# Altium project PCB_Project.PrjPcb (part 2 of 2)
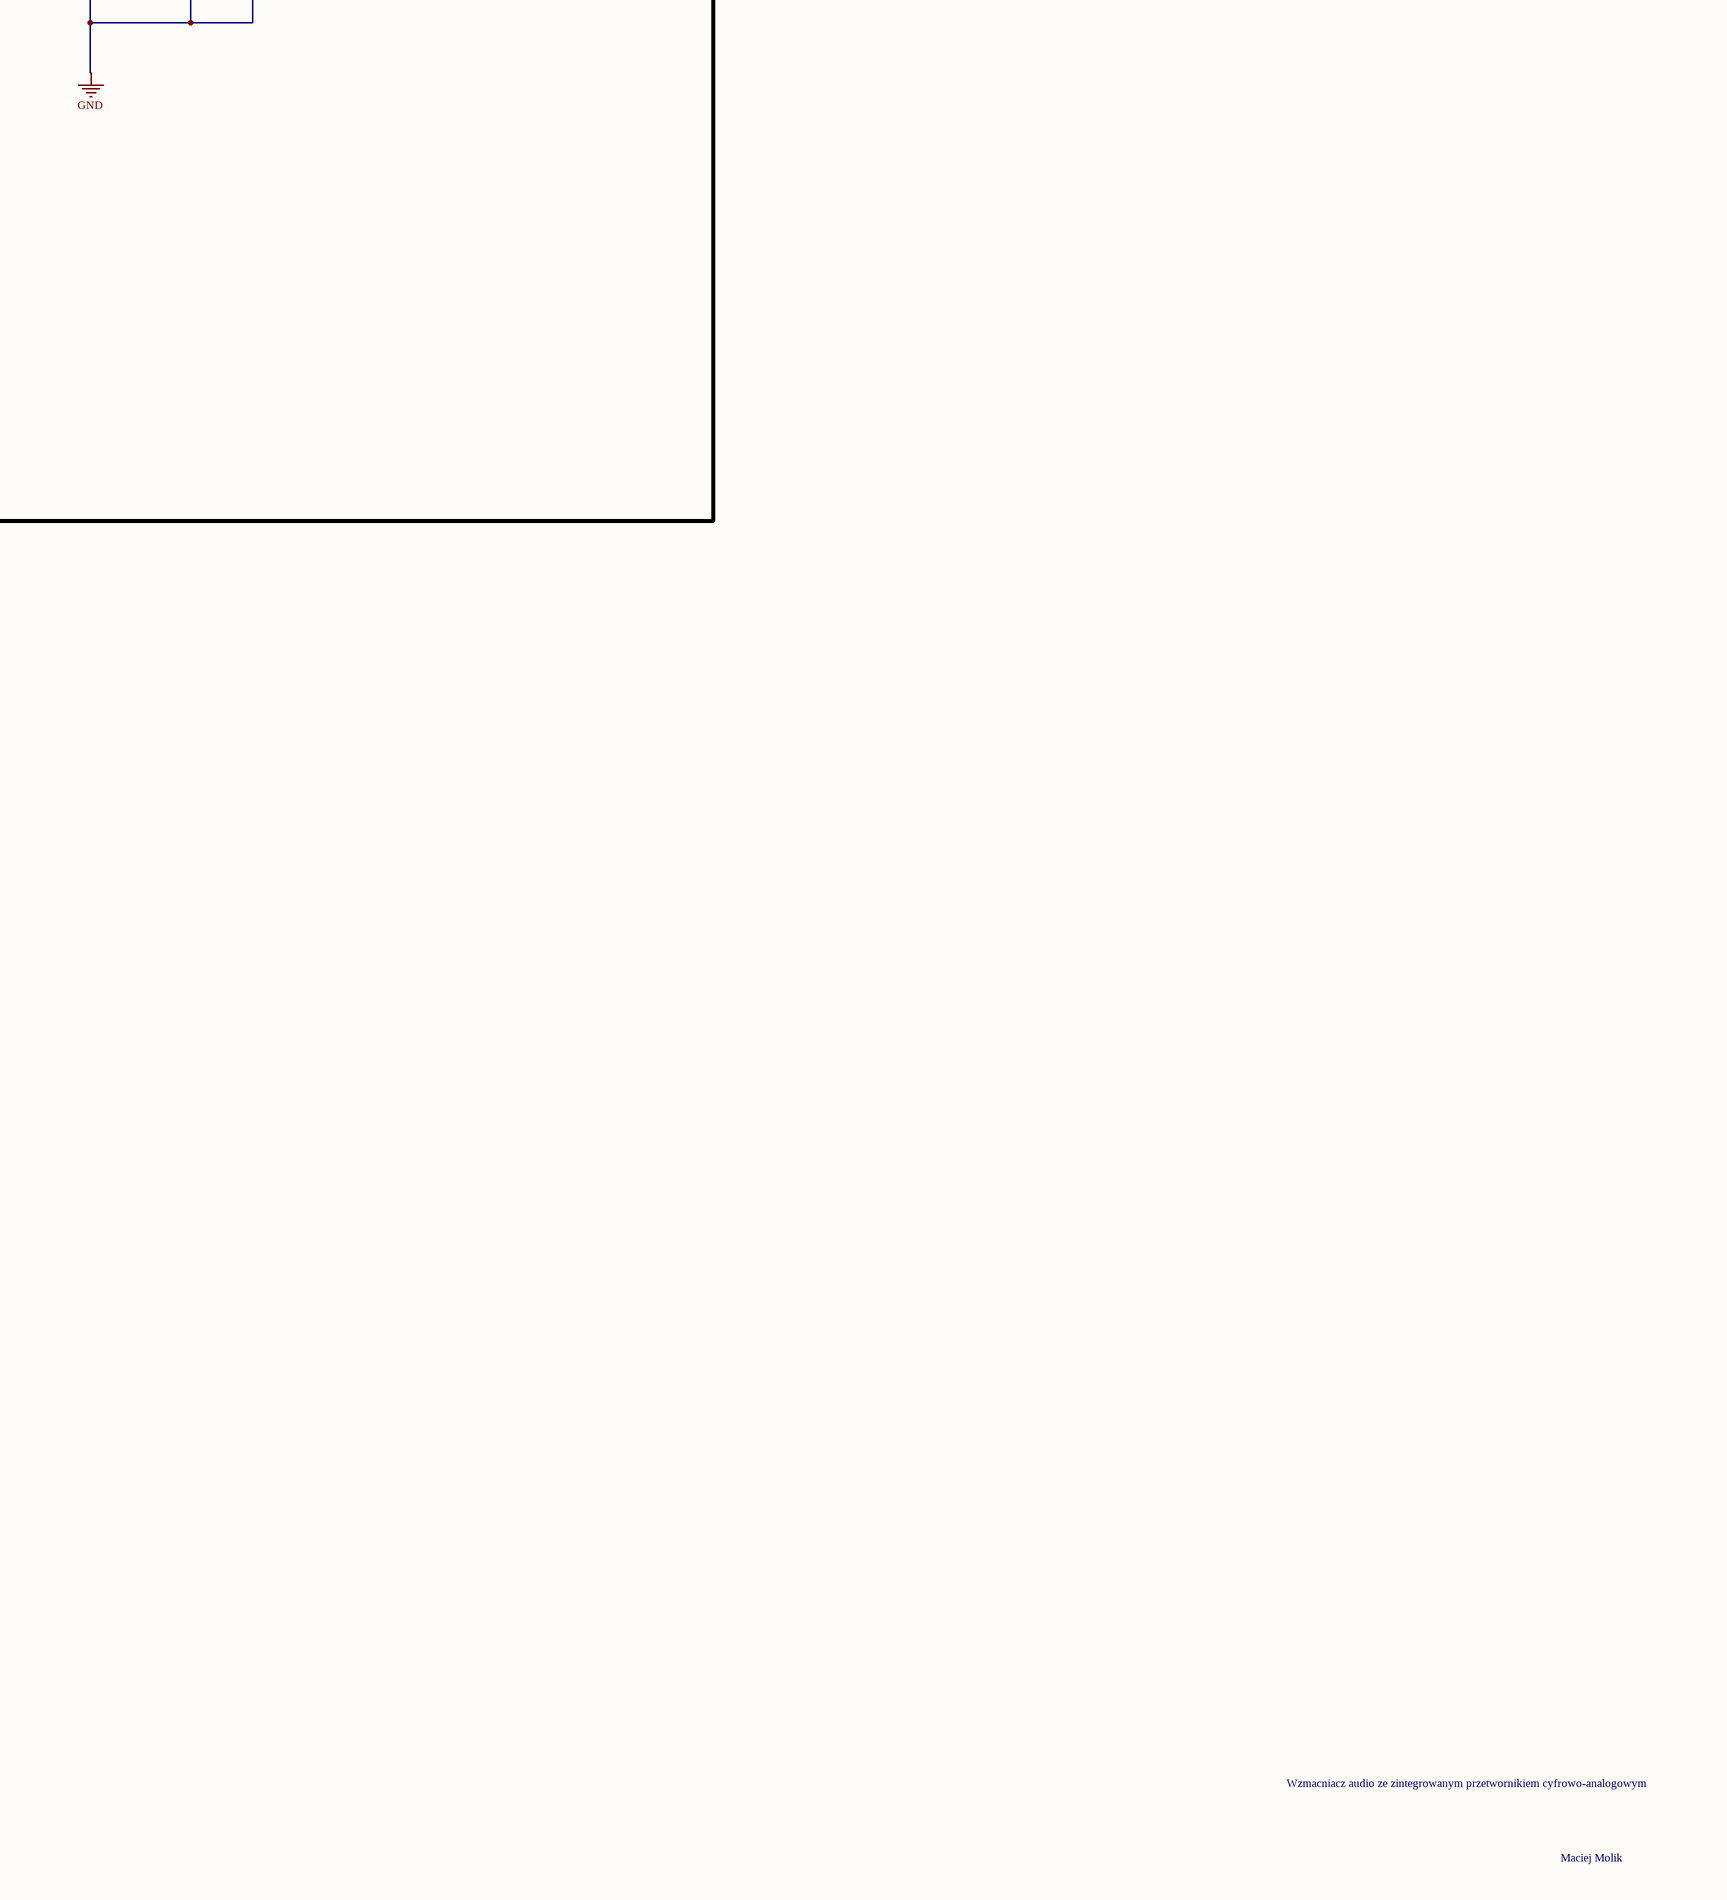
[diagram p6: Wzmacniacz audio.SchDoc, bottom right]

## Sheet Wzmacniacz audio.SchDoc (continued)

### Library data of the parts
C10 C12 C13 C18 C23 C111 = CMP-05427-001036-1: Aluminum Electrolytic Capacitors (Radial Lead Type) AEC-Q200 Qualified 10uF ±20% 50V; Ripple Current: 125mA; ESR (Equivalent Series Resistance): 1.3R; Life (Hours): 1000Hour; Lead Diameter: 0.5mm; Polarity: Polar; Max Operating Temperature: 105°C; Tolerance: 20%; Voltage Rating: 50V; Radiation Hardening: No; Packaging: Tape and Reel; Case/Package: Radial; Contact Plating: Tin; Height - Seated (Max): 0.472inch; Height: 11mm; Lead Pitch: 2.5mm; Mount: Through Hole; Termination: Radial; Impedance: 1.3R; RoHS Compliant: Yes; Diameter: 5mm; Min Operating Temperature: -55°C; Series: FC; Length: 11mm; Voltage Rating (DC): 50V; Package Quantity: 2000; Ratings: AEC-Q200
C11 C14 C15 C19-C22 C24 C26 C28 C45 C54 C56 C58 C59 C210 C212 C214 C216 C218 C220 C222 C224 C226 C228 C235-C238 C246 C247 C250 C251 C253-C256 C264 C265 C412 C511 C513 = CMP-2100-03643-1: Chip Capacitor, 0.1 uF, +/- 10%, 50 V, -55 to 125 degC, 0603 (1608 Metric), RoHS, Tape and Reel; Manufacturer: Murata; Dielectric Material: Ceramic; Voltage Rating: 50V; Dielectric: X7R; Insulation Resistance: 10GR; Case Code (Metric): 1608; Lead Free: LeadFree; Depth: 0.8mm; Number of Pins: 2; Radiation Hardening: No; Case/Package: 0603; Manufacturer URL: http://www.murata.com/; Packaging: TapeandReel; Length: 1.6mm; Contact Plating: Tin; Datasheet URL: http://psearch.en.murata.com/capacitor/product/GRM188R71H104KA93%23.pdf; Tolerance: 10%; Case Code (Imperial): 0603; Min Operating Temperature: -55degC; RoHSCompliant: true; Voltage: 50V; Termination: SMD/SMT; Mount: SurfaceMount; Material: Ceramic; Package Quantity: 1; Height: 0.8mm; Thickness: 0.035inch; REACH SVHC: NoSVHC; Max Operating Temperature: 125degC; Width: 0.8mm; Package Reference: 0603; Voltage Rating (DC): 50V; Datasheet Version: 42675.0; Package Description: 2-Pin Surface Mount Device, Body 1.6 x 0.8 mm
C16 C17 = CMP-2006-03702-3: CAP CER 18PF 50V C0G/NP0 0603; Manufacturer: KEMET; Automotive Grade: Grade 1; Tolerance: 0.05; Temperature Coefficient: 30ppm/°C; Temperature Characteristic: C0G; Material: Ceramic; ComponentLink2URL: https://api.kemet.com/component-edge/download/datasheet/C0603C100J5GACAUTO.pdf; Value: 18 pF; Device Class L3: Ceramic Capacitors; Digikey Description: CAP CER 18PF 50V C0G/NP0 0603; RoHS: TRUE; Category: Cap; Temperature Range Low: -55°C; Lead Free: Yes; Device Class L1: Passive Components; Device Class L2: Capacitors; Package: C0603C-CF; Manufacturer Part Number: C0603C180J5GACTU; Mouser Description: Capacitor; Ceramic; Cap; 18.0pF; Tol 5%; SMT; Vol-Rtg 50V; C0G; Tape and Reel; Temperature Range High: +125°C; Temperature: -55°C to +125°C; Octopart: https://octopart.com/c0603c180j5gactu-kemet-97992; ComponentLink2Description: Datasheet; Automotive: Yes; Voltage Rating: 50 V; Height: 0.87mm
C25 = CMP-2000-07372-2: CAP ALUM 47UF 20% 100V SMD; Life (Hours): 2000Hour; Ripple Current (AC): 230mA; Dissipation Factor: 0.08%; Leakage Current: 141uA; Lead Diameter: 1.1mm; Diameter: 10mm; Termination: SMD/SMT; Voltage: 100V; Tolerance: 20%; Voltage Rating: 100V; Packaging: Tape and Reel; Height - Seated (Max): 0.394inch; Case/Package: Radial; Features: General Purpose; Lead Pitch: 4.5mm; Height: 10mm; Min Operating Temperature: -55°C; REACH SVHC: No SVHC; Radiation Hardening: No; Length: 10mm; RoHS Compliant: Yes; Construction: Cylindrical; Package Quantity: 500; Voltage Rating (DC): 100V; Ripple Current: 230mA; Series: UX; Max Operating Temperature: 105°C; Mount: Surface Mount
C27 C29 C211 C213 C215 C217 C219 C221 C223 C225 C227 C229 = CMP-13271-003017-1: Cap Ceramic 4.7uF 10V X5R ±10% Pad SMD 0603 +85°C T/R; Case/Package: 0603; Packaging: Tape and Reel; Width: 0.031inch; Contact Plating: Tin; Thickness: 0.035inch; Package Quantity: 1; Voltage Rating: 10V; Case Code (Metric): 1608; Case Code (Imperial): 0603; Depth: 0.8mm; Height: 0.8mm; Tolerance: 10%; Max Operating Temperature: 85°C; Length: 1.6mm; Dielectric: X5R; Mount: Surface Mount; Radiation Hardening: No; Min Operating Temperature: -55°C
C40 C47 C50-C53 C55 C57 C510 C512 C514 = CMP-03017-000023-1: CAP TANT 220UF 10% 16V 2917; Leakage Current: 35.2uA; ESR (Equivalent Series Resistance): 900mR; Dielectric Material: Tantalum; Height: 2.8mm; Case/Package: 2917; Length: 7.3mm; Min Operating Temperature: -55°C; Lead Free: Lead Free; Depth: 4.3mm; Voltage Rating: 16V; Width: 0.169inch; Mount: Surface Mount; Max Operating Temperature: 125°C; Series: T491; Construction: Flat; Number of Pins: 2; Voltage Rating (DC): 16V; Packaging: Cut Tape; RoHS Compliant: Yes; Radiation Hardening: No; Case Code (Metric): 7343; Height - Seated (Max): 0.122inch; Termination: SMD/SMT; REACH SVHC: No SVHC; Voltage: 16V; Features: General Purpose; Case Code (Imperial): 2917; Package Quantity: 1; Tolerance: 10%
C41 C43 C44 C49 C410 C411 = CMP-05427-002115-1: CAP ALUM 330UF 20% 35V SMD; ESR (Equivalent Series Resistance): 80mR; Ripple Current: 850mA; Dielectric Material: Aluminium; Lead Length: 3.5mm; Life (Hours): 2000Hour; Leakage Current: 115.5uA; Length: 10.2mm; Construction: Cylindrical; Package Quantity: 500; Termination: SMD/SMT; RoHS Compliant: Yes; Impedance: 80mR; Width: 10.3mm; Height - Seated (Max): 0.402inch; Voltage: 35V; Voltage Rating: 35V; Diameter: 10mm; Contact Plating: Tin; Number of Pins: 2; Case/Package: Radial; Reach SVHC Compliant: Yes; Lead Free: Lead Free; Series: FK; Ripple Current (AC): 850mA; Tolerance: 20%; Ratings: AEC-Q200; Lead Pitch: 4.6mm; Mount: Surface Mount; Height: 10.2mm; Max Operating Temperature: 105°C; Packaging: Tape and Reel; Min Operating Temperature: -55°C; Voltage Rating (DC): 35V; Radiation Hardening: No
C42 C48 = CMP-08246-007079-1: Multilayer Ceramic Capacitors 3.3uF ±10% 50V X7R SMD 1210; Lead Free: Lead Free; Weight: 0.000564oz; Length: 3.2mm; Case Code (Imperial): 1210; Dielectric Material: Ceramic; Depth: 2.5mm; Min Operating Temperature: -55°C; Mount: Surface Mount; Voltage Rating (DC): 50V; Voltage Rating: 50V; Tolerance: 10%; Packaging: Tape and Reel; Voltage: 50V; Series: C; Dielectric: X7R; Construction: Flat; Thickness: 0.11inch; Height: 2.5mm; Case/Package: 1210; Width: 0.098inch; Number of Pins: 2; Case Code (Metric): 3225; Termination: SMD/SMT; Max Operating Temperature: 125°C; Radiation Hardening: No; Resistor Type: Ceramic; REACH SVHC: No SVHC; Package Quantity: 1; RoHS Compliant: Yes
C46 C413 = CMP-00287-39480675-1: EEV-FK1E222M Aluminum Electrolytic Capacitor, Polarized, Aluminum (wet), 35V, 20% +Tol, 20% -Tol, 100uF; Voltage: 25V; Leakage Current: 3µA; ESR (Equivalent Series Resistance): 35mΩ; Ripple Current (AC): 1.8A; Life (Hours): 2000hours; Case/Package: Radial; Max Operating Temperature: 105°C; Packaging: Cut Tape; Height: 16.5mm; Radiation Hardening: No; Lifecycle Status: Production; Contact Plating: Tin; Tolerance: 20%; REACH SVHC: No SVHC; NexarPartId: 39480675; Voltage Rating (DC): 25V; Diameter: 16mm; Width: 1.2mm; Mount: PCB, Surface Mount; Length: 17mm; Termination: SMD/SMT; Lead Free: Lead Free; Height - Seated (Max): 16.51mm; Ripple Current: 1.8A; Schedule B: 8532220020, 8532220020; Voltage Rating: 25V; Impedance: 35mΩ; RoHS: Compliant; Min Operating Temperature: -55°C
C110 = CMP-1037-04187-2: CAP CER 0.1UF 25V NP0 1206; Manufacturer: KEMET; Material: Ceramic; Tolerance: 0.02; Automotive Grade: Grade 0; Temperature Characteristic: C0G; Temperature Coefficient: 15%; Value: 0.10 μF; Mouser Description: Multilayer Ceramic Capacitors MLCC - SMD/SMT 25volts 0.1uF 2% C0G; Ipc Land Pattern Name: CAPC320160X78; Device Class L2: Capacitors; Device Class L3: Ceramic Capacitors; Package: C1206C-EB; Temperature: -55°C to +150°C; Temperature Range High: +150°C; Height: 0.88mm; Manufacturer Part Number: C1206C104G3GACTU; Voltage Rating: 25 V; Device Class L1: Passive Components; Temperature Range Low: -55°C; ComponentLink2URL: https://content.kemet.com/datasheets/KEM_C1007_X8R_ULTRA_150C_SMD.pdf; RoHS: TRUE; Lead Free: Yes; Category: Cap; ComponentLink2Description: Datasheet; Digikey Description: CAP CER 0.1UF 25V NP0 1206; Octopart: https://octopart.com/c1206c104g3gactu-kemet-13131404; Automotive: Yes
C112 = CMP-2006-03333-2: CAP CER 4700PF 50V 5% NP0 0603; Manufacturer: KEMET; Automotive Grade: Grade 1; Temperature Coefficient: 30ppm/°C; Tolerance: 0.05; Capacitance: 4.7 pF; Temperature Characteristic: C0G; Material: Ceramic; RoHS: TRUE; Device Class L1: Passive Components; Category: Cap; Device Class L3: Ceramic Capacitors; Height: 0.87mm; Temperature: -55°C to +125°C; Octopart: https://octopart.com/c0603c472j5gactu-kemet-9145067; Automotive: Yes; Mouser Description: Multilayer Ceramic Capacitors MLCC - SMD/SMT 50volts 4700pF 5% C0G; Temperature Range High: +125°C; Lead Free: Yes; Manufacturer Part Number: C0603C472J5GACTU; Device Class L2: Capacitors; ComponentLink2Description: Datasheet; Voltage Rating: 50 V; Digikey Description: CAP CER 4700PF 50V 5% NP0 0603; Package: C0603C-CF; ComponentLink2URL: https://api.kemet.com/component-edge/download/datasheet/C0603C100J5GACAUTO.pdf; Temperature Range Low: -55°C
C113 = CMP-001-00085-1: CAPACITOR POLY FILM 0.068UF, 100V, 5%, RAD; Capacitance:0.068ÂµF; Capacitance Tolerance:Â± 5%; Capacitor Case Style:-; Capacitor Dielectric Type:Polyester (PET); Capacitor Mounting:Through Hole; Capacitor Terminals:Radial Leaded RoHS Compliant: Yes; MF: TDK Electronics; Component Type: Standard; Check_prices: https://www.snapeda.com/parts/B32529C1683J000/TDK/view-part/?ref=eda; SnapEDA_Link: https://www.snapeda.com/parts/B32529C1683J000/TDK/view-part/?ref=snap; Design Item ID: B32529C1683J000; Source: B32529C1683J000.SchLib; Pins: 2; MP: B32529C1683J000; Case/Package: NON-STANDARD-2 TDK
C230 C233 C240 C249 C252 C258 = CMP-2006-03418-2: CAP CER 100PF 50V 1% NP0 0603; Manufacturer: KEMET; Material: Ceramic; Temperature Characteristic: C0G; Temperature Coefficient: 30ppm/°C; Tolerance: 0.01; Automotive Grade: Grade 1; Lead Free: Yes; Manufacturer Part Number: C0603C101F5GACTU; Height: 0.87mm; Octopart: https://octopart.com/c0603c101f5gactu-kemet-8293493; Device Class L2: Capacitors; Device Class L1: Passive Components; ComponentLink2Description: Datasheet; Capacitance: 100 pF; Package: C0603C-CF; Digikey Description: CAP CER 100PF 50V 1% NP0 0603; Device Class L3: Ceramic Capacitors; Mouser Description: Multilayer Ceramic Capacitors MLCC - SMD/SMT 50volts 100pF C0G 1%; Temperature: -55°C to +125°C; Category: Cap; Temperature Range High: +125°C; Temperature Range Low: -55°C; RoHS: TRUE; Voltage Rating: 50 V; Automotive: Yes; ComponentLink2URL: https://api.kemet.com/component-edge/download/datasheet/C0603C100J5GACAUTO.pdf
C231 C239 C243 C257 C261 C267 = CMP-2006-02595-1: Manufacturer: Murata; Part Number: GRM1885C1H101JA01D
C232 C234 = CMP-00131-20738524-1: B32529C1104J000 Cap Film 0.1uF 100V PET 5% (7.3 X 2.5 X 6.5mm) Radial Stacked 5mm 125C Automotive Bulk; Lead Diameter: 500µm; Dielectric Material: Polyester; Lifecycle Status: Production; Length: 7.2mm; Dielectric: PET; Min Operating Temperature: -55°C; Max Width: 2.5mm; Tolerance: 5%; Voltage Rating (DC): 100V; Height: 6.5mm; RoHS: Compliant; Radiation Hardening: No; Case/Package: Radial; NexarPartId: 20738524; Lead Pitch: 5mm; Voltage Rating: 100V; REACH SVHC: Unknown; Schedule B: 8532250010, 8532250010; Max Operating Temperature: 125°C; Max Length: 7.3mm; Depth: 2.5mm; Packaging: Bulk; Voltage Rating (AC): 100V
C241 C245 C259 C263 = CMP-1035-02080-3: CAP CER 2700NF 50V C0G/NP0 0603; Manufacturer: KEMET; Material: Ceramic; Temperature Coefficient: 30ppm/°C; Temperature Characteristic: C0G; Tolerance: 0.05; Automotive Grade: Grade 1; Value: 2,700 nF; Device Class L1: Passive Components; Lead Free: Yes; Manufacturer Part Number: C0603C272J5GACTU; Octopart: https://octopart.com/c0603c272j5gactu-kemet-12563758; ComponentLink2Description: Datasheet; ComponentLink2URL: https://api.kemet.com/component-edge/download/datasheet/C0603C100J5GACAUTO.pdf; Category: Cap; Device Class L2: Capacitors; RoHS: TRUE; Automotive: Yes; Height: 0.87mm; Package: C0603C-CF; Mouser Description: Multilayer Ceramic Capacitors MLCC - SMD/SMT 50volts 2700pF 5% C0G; Device Class L3: Ceramic Capacitors; Temperature Range Low: -55°C; Voltage Rating: 50 V; Temperature: -55°C to +125°C; Temperature Range High: +125°C; Digikey Description: CAP CER 2700PF 50V C0G/NP0 0603
C242 C244 C260 C262 = CMP-06035-024846-1: Chip Multilayer Ceramic Capacitors for General Purpose, 0603, 5600pF, C0G, 30ppm/°C, 5%, 50V; Width: 0.031inch; Case Code (Metric): 1608; Voltage Rating (DC): 50V; Length: 1.6mm; Termination: SMD/SMT; Packaging: Tape and Reel; Lead Pitch: 0.5mm; Package Quantity: 4000; Max Operating Temperature: 125°C; Thickness: 0.035inch; Tolerance: 5%; Dielectric: C0G; Depth: 0.8mm; Mount: Surface Mount; Min Operating Temperature: -55°C; Case Code (Imperial): 0603; Case/Package: 0603; Lead Free: Lead Free; Height: 0.8mm; Voltage Rating: 50V
C248 C266 = CMP-2006-02664-2: Chip Multilayer Ceramic Capacitors for General Purpose, 0603, 3900pF, C0G, 30ppm/°C, 5%, 50V; Voltage: 50V; Packaging: Tape and Reel; Case Code (Metric): 1608; Temperature Coefficient: 30ppm/°C; Package Quantity: 4000; Case/Package: 0603; Length: 1.6mm; Width: 0.031inch; Dielectric: C0G; Max Operating Temperature: 125°C; Case Code (Imperial): 0603; Radiation Hardening: No; Voltage Rating: 50V; Mount: Surface Mount; Min Operating Temperature: -55°C; Depth: 0.8mm; Voltage Rating (DC): 50V; Tolerance: 5%; Termination: SMD/SMT; Height: 0.8mm; Material: Ceramic; Lead Free: Lead Free; Thickness: 0.035inch
D50 D51 = CMP-56207-000002-1: BRIDGE RECT 1P 600V 500MA MBS-1; Manufacturer: MCC; Value: 13pF; Max Surge Forward Current: 35A; Standoff Height: 0.05mm; Max Junction Temp: +150°C; Forward Current: 0.5A; Peak Reverse Current: 5uA; Temperature: -55°C to +150°C; Temperature Range High: +150°C; Package: MBS-1; Temperature Range Low: -55°C; Octopart: https://octopart.com/mb6s-tp-mcc-733391; Max Repetitive Reverse Voltage: 600V; Mouser Description: Bridge Rectifiers .5A 600V; ComponentLink2URL: https://www.mccsemi.com/pdf/Products/MB05S-MB10S(MBS-1)-H.pdf; Reverse Voltage: 600V; ComponentLink2Description: Datasheet; Height: 2.9mm; Manufacturer Part Number: MB6S-TP; Lead Free: Yes; RoHS: TRUE; Category: Diode; Device Class L2: Diodes; Digikey Description: BRIDGE RECT 1P 600V 500MA MBS-1; Device Class L1: Discrete Semiconductors; Automotive: No; Device Class L3: Rectifier Diodes; Capacitance: 13pF
FB20-FB22 = CMP-2000-05400-1: Chip Bead for Power Line, 600 Ohm, +/- 25%, 2 A, -55 to 125 degC, 2-Pin SMD (0805), RoHS, Tape and Reel; Manufacturer: TDK; Maximum DC Current: 2A; Impedance: 600Ohms; Test Frequency: 100MHz; Case Length: 2mm; Maximum DC Resistance: 100mOhms; Case Height: 0.85mm; Case Width: 1.25mm; Factory Pack Quantity: 4000; Operating Temperature Range: -55Cto+125C; Packaging: Reel; Datasheet URL: https://datasheet.ciiva.com/23763/1750041-23763249.pdf; Manufacturer URL: http://www.tdk.com/; Product Category: EMIFilterBeads,Chips&Arrays; Tolerance: 25%; Product: FerriteChipBeads; Package / Case: 0805(2012metric); RoHS: Details; Dimensions: 1.25mmWx2mmLx0.85mmH; Datasheet Version: Jul-13; Termination Style: SMD/SMT; Package Reference: 805; Brand: TDK; Package Description: 2-Pin Surface Mount Device, Body 2 x 1.25 mm
J10 = CMP-010-000000-1: Metal Right-Angle, RCA Jack, White Housing and Insulation; MF: Same Sky; Source: RCJ-043.SchLib; Pin Count: 2; Check_prices: https://www.snapeda.com/parts/RCJ-043/Same+Sky/view-part/?ref=eda; Value: *; Component Type: Standard; Design Item ID: RCJ-043; MP: RCJ-043; Package: None; SnapEDA_Link: https://www.snapeda.com/parts/RCJ-043/Same+Sky/view-part/?ref=snap
J40 J41 J50 J51 = CMP-1559-00412-1: OMNIMATE Signal - series BC/SC 3.81; Manufacturer: Weidmueller; UL_94_flammability_rating: V-0; Rated_voltage_use_group_B_UL_1059: 300 V; Pitch_mm: 3.81 mm; Mounting_onto_the_PCB: Reflow solder connection; Insulating_material: LCP GF; Rated_voltage_for_surge_voltage_class_pollution_degree_II_2: 320 V; No_of_poles: 2; Outgoing_elbow: 180°; Rated_current_use_group_B_UL_1059: 10 A; Side_termination_characteristic: closed side; Pitch_inch: 0.15 inch; Solder_pin_length_mm: 1.5 mm; Short_text_for_material: SC-SMT 3.81/02/180G 1.5SN BK BX; Contact_surface: tinned; Rated_current_min_no_of_poles_TU_20_deg_C: 17.5 A; PackageReference: SC_SMT_3_81_180G_02; Revision: V1; ComponentLink2Description: URL Link1; Colour: Black; ComponentLink1Description: Manufacturer URL; Packaging: Box; PartNumber: 1863720000; Qty: 50 PCS; ComponentLink1URL: http://www.weidmueller.com/; ComponentLink2URL: http://catalog.weidmueller.com/catalog/Start.do?localeId=en&ObjectID=1863720000
Q40 Q41 Q46 Q47 = CMP-1046-00106-1: Complementary NPN Silicon Power Bipolar Transistor, 3-Pin TO-3BPL, Pb-Free, Tube; Manufacturer: On Semiconductor; fT Min (MHz): 35; hFE Max: 250; IC Continuous (A): 15; Packing: Tube; ComponentLink2URL: http://www.onsemi.cn/pub_link/Collateral/MJL4281A-D.PDF; PartNumber: MJL4281AG; ComponentLink1Description: Manufacturer URL; ComponentLink3URL: http://www.onsemi.cn/pub_link/Collateral/340G-02.PDF; Polarity: NPN; ComponentLink1URL: http://www.onsemi.com/; RoHS: TRUE; ComponentLink3Description: Package Specification; PackageReference: TO-3BPL-3-340G-02; DatasheetVersion: Rev. 3; Mounting Technology: Through Hole; ComponentLink2Description: Datasheet; PackageVersion: Rev. J, 12/2004; PackageDescription: 3-Pin Flange Mount, Vertical Straight Lead, Body 19.8 x 5 mm, Pitch 5.45 mm
Q42 Q44 = CMP-1048-01449-1: Amplifier Transistor, PNP Silicon, 3-Pin TO-92, Bulk Box; Manufacturer: On Semiconductor; IC Continuous (A): -0.1; Polarity: PNP; PartNumber: BC557C; PackageVersion: Rev. AM; RoHS: FALSE; PackageDescription: 3-Pin Transistor Outline, Body 4.825 x 3.685 mm, Pitch 1.27 mm; Packing: Bulk Box; ComponentLink2Description: Datasheet; DatasheetVersion: Rev. 3; ComponentLink3Description: Package Specification; Mounting Technology: Through Hole; ComponentLink2URL: http://www.onsemi.com/pub_link/Collateral/BC556B-D.PDF; ComponentLink1URL: http://www.onsemi.com/; ComponentLink1Description: Manufacturer URL; ComponentLink3URL: http://www.onsemi.cn/pub_link/Collateral/2N6426-D.PDF; PackageReference: TO-92-3-29-11_AM_SL
Q43 Q45 = CMP-1048-01271-1: Plastic Medium-Power Silicon NPN Transistor, 3-Pin TO-225, Bulk Box; Manufacturer: On Semiconductor; IC Continuous (A): 1.5; Packing: Bulk Box; ComponentLink2URL: http://www.onsemi.com/pub_link/Collateral/BD135-D.PDF; ComponentLink2Description: Datasheet; ComponentLink1URL: http://www.onsemi.com/; Polarity: NPN; PartNumber: BD139; ComponentLink1Description: Manufacturer URL; RoHS: FALSE; ComponentLink3Description: Package Specification; PackageReference: TO-225-3-77-09; Mounting Technology: Through Hole; DatasheetVersion: Rev. 16; PackageDescription: 3-Pin Flange Mount, Vertical Straight Lead, Body 7.6 x 2.7 mm, Pitch 2.29 mm; PackageVersion: Rev. AC, 12/2013; ComponentLink3URL: http://www.onsemi.com/pub_link/Collateral/77-09.PDF
R10 = CMP-04015-064187-1: 75Ω ±1% 0.125W, 1/8W Chip Resistor 0805 (2012 Metric) Moisture Resistant Thin Film
R11 = CMP-04015-027670-1: 47Ω ±0.1% 0.125W, 1/8W Chip Resistor 0805 (2012 Metric) Moisture Resistant Thin Film
R12 = CMP-03412-033768-1: RES SMD 2.2K OHM 1% 1/10W 0603; Manufacturer: Yageo; Temperature Coefficient: 50 ppm/°C; Power Rating: 0.1W; Value: 2.2KΩ; Tolerance: 0.01; Voltage Rating: 75V; Package: RT0603; Digikey Description: RES SMD 2.2K OHM 1% 1/10W 0603; Octopart: https://octopart.com/rt0603fre072k2l-yageo-40019811; ComponentLink2URL: http://www.yageo.com/documents/recent/PYu-RT_1-to-0.01_RoHS_L_9.pdf; Temperature Range Low: -55°C; Height: 0.55mm; Footprint Url: http://www.yageo.com/exep/pages/download/literatures/PYu-R_Mount_10.pdf; ComponentLink2Description: Datasheet; Device Class L1: Passive Components; RoHS: TRUE; Device Class L3: Chip SMD Resistors; Composition: Thin Film; Device Class L2: Resistors; Manufacturer Part Number: RT0603FRE072K2L; Mouser Description: High Precision-High Stability Chip Resistor Thin Film 0603 2.2kOhm 1% Paper T/R; Automotive: No; Category: Res; Temperature Range High: +155°C; Lead Free: Yes; Temperature: -55°C to +155°C; Series: RT; Ipc Land Pattern Name: RESC16080X45
R13 = CMP-04015-051406-1: 470Ω ±0.1% 0.125W, 1/8W Chip Resistor 0805 (2012 Metric) Moisture Resistant Thin Film
R14-R25 R30 R31 R110-R112 = CMP-2000-03835-2: RES SMD 10KΩ OHM 1% 1/3W 0603; Voltage Rating (DC): 75V; Max Power Dissipation: 250mW; Temperature Coefficient: 100ppm/°C; Case Code (Metric): 1608; Features: Automotive AEC-Q200; Termination: SMD/SMT; Number of Terminations: 2; Case Code (Imperial): 0603; Tolerance: 1%; Depth: 0.85mm; Package Quantity: 10; Length: 1.6mm; Packaging: Tape and Reel; Contact Plating: Tin; Radiation Hardening: No; Case/Package: 0603; Composition: Thick Film; Voltage Rating: 75V; Weight: 7.1E-05oz; Max Operating Temperature: 155°C; Lead Free: Lead Free; Width: 0.033inch; Power Rating: 250mW; Min Operating Temperature: -55°C; Military Standard: Not; Height: 0.45mm
R26 = CMP-009-00179-1: 2.49 kOhms Â±1% 0.1W, 1/10W Chip Resistor 0603 (1608 Metric) Moisture Resistant Thick Film; MF: Yageo; SnapEDA_Link: https://www.snapeda.com/parts/RC0603FR-072K49L/Yageo/view-part/?ref=snap; Check_prices: https://www.snapeda.com/parts/RC0603FR-072K49L/Yageo/view-part/?ref=eda; MP: RC0603FR-072K49L; Pins: 2; Component Type: Standard; Source: RC0603FR-072K49L.SchLib; Case/Package: SMD-2 Yageo; Design Item ID: RC0603FR-072K49L
R27-R29 R212 R222-R224 R227 = CMP-2000-04430-1: Manufacturer: Yageo; Part Number: RT0603BRD072KL
R40 R410 = CMP-2000-06940-1: Chip Resistor, 39 KOhm, +/- 1%, 0.1 W, -55 to 155 degC, 0603 (1608 Metric), RoHS, Tape and Reel; Manufacturer: Yageo; Voltage Rating: 50V; Power Rating: 100mW; Temperature Coefficient: 100PPM/C; Product: ThickFilmResistorsGeneralPurpose; Case Code - in: 0603; Tolerance: 1%; Operating Temperature Range: -55Cto+155C; Series: RC; Package Description: 2-Pin Surface Mount Device, Body 1.6 x 0.8 mm; Datasheet URL: http://www.yageo.com/documents/recent/PYu-RC_Group_51_RoHS_L_7.pdf; Package Reference: 0603; Case Code - mm: 1608; Datasheet Version: Rev. 7, 05/2017; Mounting Technology: SurfaceMount; Packaging: Reel; Manufacturer URL: http://www.yageo.com/; Termination Style: SMD/SMT
R41 R411 = CMP-009-00182-1: 220 Ohms Â±1% 0.5W, 1/2W Chip Resistor 0805 (2012 Metric) Automotive AEC-Q200, Pulse Withstanding Thick Film; MF: Panasonic; Pins: 2; Design Item ID: ERJ-P6WF2200V; SnapEDA_Link: https://www.snapeda.com/parts/ERJ-P6WF2200V/Panasonic/view-part/?ref=snap; Check_prices: https://www.snapeda.com/parts/ERJ-P6WF2200V/Panasonic/view-part/?ref=eda; Source: ERJ-P6WF2200V.SchLib; MP: ERJ-P6WF2200V; Case/Package: 2012 Panasonic Electronic Components; Component Type: Standard
R42 R412 = CMP-2000-00071-2: RES SMD 470 OHM 0.1% 1/10W 0603; Temperature Coefficient: 25ppm/°C; Power Rating: 100mW; Voltage Rating: 75V; Mount: Surface Mount; Size Code: 0603; Contact Plating: Tin; Military Standard: Not; Resistor Type: Thin Film; Width: 0.8mm; Length: 1.6mm; Technology: THIN FILM; RoHS Compliant: Yes; Number of Terminations: 2; Series: ERA-3A; Number of Pins: 2; Construction: Rectangular; Radiation Hardening: No; Max Operating Temperature: 155°C; Termination: SMD/SMT; Case Code (Imperial): 0603; Case Code (Metric): 1608; Tolerance: 0.1%; Packaging: Tape and Reel; Depth: 0.8mm; REACH SVHC: No SVHC; Case/Package: 0603; Min Operating Temperature: -55°C; Lead Free: Lead Free; Package Quantity: 1; Resistance Tolerance: 0.1%; Voltage Rating (DC): 75V; Max Power Dissipation: 100mW; Features: Automotive AEC-Q200; Height: 0.45mm
R43 R413 = CMP-009-00183-1: 2.7 kOhms Â±1% 0.5W, 1/2W Chip Resistor 0805 (2012 Metric) Automotive AEC-Q200, Pulse Withstanding Thick Film; MF: Panasonic; MP: ERJ-P6WF2701V; Design Item ID: ERJ-P6WF2701V; Case/Package: 2012 Panasonic Electronic Components; SnapEDA_Link: https://www.snapeda.com/parts/ERJ-P6WF2701V/Panasonic/view-part/?ref=snap; Component Type: Standard; Source: ERJ-P6WF2701V.SchLib; Check_prices: https://www.snapeda.com/parts/ERJ-P6WF2701V/Panasonic/view-part/?ref=eda; Pins: 2
R44 R414 = CMP-2002-00170-1: Manufacturer: Vishay Dale; Part Number: CRCW040268K0FKED
R45 R415 = CMP-2000-00875-2: NexarPartId: 1243428; Power Rating: 100mW; Voltage Rating (DC): 75V; Tolerance: 0.1%; Temperature Coefficient: 25ppm/°C; Contact Plating: Tin; Max Operating Temperature: 155°C; Case Code (Imperial): 0603; Packaging: Cut Tape; Width: 800µm; Lead Free: Lead Free; REACH SVHC: No SVHC; Termination: SMD/SMT; Radiation Hardening: No; Length: 1.6mm; Military Standard: Not; Features: Automotive AEC-Q200; Case/Package: 0603; Number of Terminations: 2; Composition: Thin Film; Schedule B: 8533210045, 8533210045; Voltage Rating: 75V; Mount: Surface Mount; Case Code (Metric): 1608; Lifecycle Status: Production; Height: 450µm; RoHS: Compliant; Number of Pins: 2; Max Power Dissipation: 100mW; Min Operating Temperature: -55°C; Depth: 800µm; Working Voltage: 75V
R46 R416 = CMP-1659-00040-2: NexarPartId: 40301092; Voltage Rating (AC): 50V; Power Rating: 100mW; Temperature Coefficient: 100ppm/°C; Tolerance: 1%; Number of Terminations: 2; Length: 1.6mm; Height: 450µm; Composition: Thick Film; Case Code (Imperial): 0603; Features: Moisture Resistant; Width: 800µm; Max Operating Temperature: 155°C; Lead Pitch: 300µm; Voltage Rating: 50V; Termination: SMD/SMT; Case Code (Metric): 1608; Max Power Dissipation: 100mW; REACH SVHC: No SVHC; Number of Pins: 2; Min Operating Temperature: -55°C; Case/Package: 0603; Packaging: Tape & Reel; Voltage Rating (DC): 50V; Schedule B: 8533210045, 8533210045; Lead Free: Lead Free; RoHS: Compliant; Military Standard: Not; Depth: 800µm
R47 R417 = CMP-009-00181-1: RES, THICK FILM, 80R6, 1%, 0.2W, 0603; MP: ERJ-P03F80R6V; MF: Panasonic; Source: ERJP03F80R6V.SchLib; Check_prices: https://www.snapeda.com/parts/ERJ-P03F80R6V/Panasonic/view-part/?ref=eda; Component Type: Standard; SnapEDA_Link: https://www.snapeda.com/parts/ERJ-P03F80R6V/Panasonic/view-part/?ref=snap; Case/Package: 1608-2 Panasonic; Pins: 2; Design Item ID: ERJP03F80R6V
R48 R418 = CMP-02407-002229-1: RES Thick Film, 1.5kΩ, 1%, 0.25W, 100ppm/°C, 1206; Voltage Rating (DC): 200V; Power Rating: 250mW; Depth: 1.6mm; Case/Package: 1206; Packaging: Tape and Reel; Military Standard: Not; Radiation Hardening: No; Features: Automotive AEC-Q200; Number of Terminations: 2; Case Code (Imperial): 1206; Width: 0.063inch; Voltage Rating: 200V; Tolerance: 1%; Max Operating Temperature: 155°C; Weight: 0.000353oz; Package Quantity: 10; Temperature Coefficient: 100ppm/°C; Lead Free: Lead Free; Height: 0.024inch; Max Power Dissipation: 250mW; Termination: SMD/SMT; Length: 3.2mm; Contact Plating: Tin; Composition: Thick Film; Min Operating Temperature: -55°C; Case Code (Metric): 3216
R49 R419 = CMP-2000-00874-2: RES SMD 10K OHM 0.1% 1/10W 0603; Voltage Rating (DC): 75V; Power Rating: 100mW; Temperature Coefficient: 25ppm/°C; Radiation Hardening: No; Width: 0.8mm; Depth: 0.8mm; Construction: Rectangular; Case Code (Metric): 1608; Package Quantity: 5000; Length: 1.6mm; Size Code: 0603; Case Code (Imperial): 0603; Termination: SMD/SMT; Contact Plating: Tin; Resistance Tolerance: 0.1%; Military Standard: Not; Packaging: Tape and Reel; Max Power Dissipation: 100mW; REACH SVHC: No SVHC; Series: ERA-3A; Voltage Rating: 75V; Lead Free: Lead Free; Technology: METAL FILM; RoHS Compliant: Yes; Max Operating Temperature: 155°C; Resistor Type: Thin Film; Min Operating Temperature: -55°C; Number of Pins: 2; Case/Package: 0603; Tolerance: 0.1%; Height: 0.45mm; Mount: Surface Mount; Number of Terminations: 2
R113 = CMP-04015-018708-1: 680Ω ±0.1% 0.125W, 1/8W Chip Resistor 0805 (2012 Metric) Moisture Resistant Thin Film
R210 R213 R218 R225 R228 R233 = CMP-2000-01958-2: Automotive Metal Thin Film Chip Resistor, 0603, 100Ω, 0.1%, 25ppm/°C, 0.1W, 100V; Max Power Dissipation: 100mW; Voltage Rating: 75V; Power Rating: 62.5mW; Length: 0.063inch; Case Code (Metric): 1608; Number of Pins: 2; Width: 0.031inch; Resistor Type: Thin Film; Number of Terminations: 2; Lead Free: Lead Free; Features: Automotive AEC-Q200; Series: RG; Min Operating Temperature: -55°C; Package Quantity: 1; Termination: SMD/SMT; Tolerance: 0.1%; Case Code (Imperial): 0603; Packaging: Tape and Reel; Size Code: 0603; Height: 0.02inch; RoHS Compliant: Yes; Voltage Rating (DC): 75V; Temperature Coefficient: 25ppm/°C; Case/Package: 0603; Max Operating Temperature: 155°C
R211 R226 = CMP-03412-014357-1: RES 402 OHM 1/16W .1% SMD 0402; Manufacturer: Yageo; Power Rating: 0.063W; Voltage Rating: 50V; Temperature Coefficient: 25 ppm/°C; Tolerance: 0.001; Value: 402Ω; Footprint Url: http://www.yageo.com/exep/pages/download/literatures/PYu-R_Mount_10.pdf; Composition: Thin Film; Series: RT; Temperature Range High: +155°C; Height: 0.35mm; Digikey Description: RES 402 OHM 1/16W .1% SMD 0402; Device Class L3: Chip SMD Resistors; Manufacturer Part Number: RT0402BRD07402RL; ComponentLink2Description: Datasheet; Ipc Land Pattern Name: RESC10050X30; Octopart: https://octopart.com/rt0402brd07402rl-yageo-1375166; Package: RT0402; ComponentLink2URL: http://www.yageo.com/documents/recent/PYu-RT_1-to-0.01_RoHS_L_9.pdf; Temperature Range Low: -55°C; Device Class L2: Resistors; Category: Res; Mouser Description: Thin Film Resistors - SMD 1/16W 402 ohm .1% 25ppm; Automotive: No; Device Class L1: Passive Components; Lead Free: Yes; RoHS: TRUE; Temperature: -55°C to +155°C
R214 R215 R229 R230 = CMP-2000-00111-1: Manufacturer: Panasonic; Part Number: ERA3AEB6810V
R216 R220 R231 R234 = CMP-28537-007394-1: Automotive Metal Thin Film Chip Resistor, 0603, 226Ω, 0.1%, 25ppm/°C, 0.1W, 100V; Power Rating: 100mW; Voltage Rating (DC): 75V; Min Operating Temperature: -55°C; Height: 0.02inch; Packaging: Tape and Reel; Weight: 7.1E-05oz; Width: 0.8mm; Tolerance: 0.1%; Features: Automotive AEC-Q200; Lead Free: Lead Free; Number of Terminations: 2; RoHS Compliant: Yes; Case Code (Metric): 1608; Max Operating Temperature: 155°C; Temperature Coefficient: 25ppm/°C; Package Quantity: 5000; Series: RG; Length: 0.063inch; Max Power Dissipation: 100mW; Resistor Type: Thin Film; Termination: SMD/SMT; Voltage Rating: 100V; Case/Package: 0603; Case Code (Imperial): 0603
R217 R221 R232 R235 = CMP-03412-021030-1: RES SMD 324 OHM 0.1% 1/10W 0603; Manufacturer: Yageo; Power Rating: 0.1W; Value: 324Ω; Temperature Coefficient: 25 ppm/°C; Voltage Rating: 75V; Tolerance: 0.001; Octopart: https://octopart.com/rt0603brd07324rl-yageo-1472397; RoHS: TRUE; ComponentLink2Description: Datasheet; Package: RT0603; Manufacturer Part Number: RT0603BRD07324RL; Device Class L3: Chip SMD Resistors; Device Class L2: Resistors; Temperature: -55°C to +155°C; Temperature Range Low: -55°C; Mouser Description: Thin Film Resistors - SMD 1/10W 324 ohm .1% 25ppm; Category: Res; Automotive: No; Lead Free: Yes; Composition: Thin Film; Ipc Land Pattern Name: RESC16080X45; Series: RT; Device Class L1: Passive Components; Digikey Description: RES SMD 324 OHM 0.1% 1/10W 0603; Footprint Url: http://www.yageo.com/exep/pages/download/literatures/PYu-R_Mount_10.pdf; Height: 0.55mm; Temperature Range High: +155°C; ComponentLink2URL: http://www.yageo.com/documents/recent/PYu-RT_1-to-0.01_RoHS_L_9.pdf
R219 R236 = CMP-03412-029579-1: RES SMD 332 OHM 0.1% 1/10W 0603; Manufacturer: Yageo; Temperature Coefficient: 25 ppm/°C; Value: 332 Ω; Tolerance: 0.001; Voltage Rating: 75V; Power Rating: 0.1W; Category: Res; Device Class L2: Resistors; Temperature Range High: +155°C; Mouser Description: Res Thin Film 0603 332 Ohm 0.1% 1/10W ±25ppm/°C Molded SMD Paper T/R; Ipc Land Pattern Name: RESC16080X45; Device Class L1: Passive Components; ComponentLink2Description: Datasheet; Series: RT; Temperature Range Low: -55°C; Temperature: -55°C to +155°C; Digikey Description: RES SMD 332 OHM 0.1% 1/10W 0603; Manufacturer Part Number: RT0603BRD07332RL; Footprint Url: http://www.yageo.com/exep/pages/download/literatures/PYu-R_Mount_10.pdf; Lead Free: Yes; Height: 0.55mm; ComponentLink2URL: http://www.yageo.com/documents/recent/PYu-RT_1-to-0.01_RoHS_L_9.pdf; RoHS: TRUE; Automotive: No; Composition: Thin Film; Package: RT0603; Octopart: https://octopart.com/rt0603brd07332rl-yageo-1261330; Device Class L3: Chip SMD Resistors
RO0-RO11 = CMP-009-00002-5: Chip Resistor, 0 Ohm, +/- 5%, 0.25 W, -55 to 155 degC, 1206 (3216 Metric); Voltage Rating: 200V; Power: 250mW; Tolerance: 5%; Min Operating Temperature: -55°C; Mounting Technology: SM; Max Operating Temperature: 155°C; Case/Package: 1206; RoHS Compliant: True; Pins: 2
SW30 SW31 = CMP-2000-05160-2: SWITCH TACTILE SPST-NO 0.05A 12V; Contact Resistance: 100mR; Throw Configuration: SPST; Illumination Type: Non-Illuminated; Mechanical Life: 100000Cycles; Current Rating: 50mA; Switch Function: Off-Mom; Actuator Length: 0.85mm; Actuator Material: Nylon; Actuator Type: Standard; Operating Force: 160gf; Min Operating Temperature: -20°C; REACH SVHC: No SVHC; Termination: Gull Wing; Case/Package: SMD/SMT; Packaging: Tape and Reel; Mount: Surface Mount; Voltage Rating (DC): 12V; Orientation: Straight; Lead Free: Lead Free; Contact Material: Silver; Color: Black; Max Current Rating: 50mA; Contact Plating: Silver; Depth: 9mm; Package Quantity: 1; Max Voltage Rating (DC): 12V; Length: 6mm; Max Operating Temperature: 60°C
U1 = CMP-0312-00068-2: 96 kHz Digital Audio Receiver, 50 ps Jitter, 3.3V, -40 to 85 degC, 28-Pin TSSOP (PW), Green (RoHS & no Sb/Br); Manufacturer: Texas Instruments; Supply Voltage(s)(V): 3.3; Jitter(ps): 50; Sampling Rate(Max)(kHz): 108; PackageVersion: revG, Feb-2011; ComponentLink2URL: http://www.ti.com/litv/pdf/mpds364; ComponentLink2Description: Package Specification; Code_JEDEC: MO-153; ComponentLink1Description: Datasheet; PackageReference: PW0028A; SubFamily: Digital Audio Receiver; PartNumber: DIR9001PW; ComponentLink1URL: http://www.ti.com/general/docs/lit/getliterature.tsp?genericPartNumber=DIR9001&fileType=pdf; Eco-Plan: Green (RoHS & no Sb/Br); PackageDescription: 28-Pin Plastic Thin Small Outline Package 9.7 x 4.4 mm Body ,0.65 mm Pitch; DatasheetVersion: SLES198; Mounting Technology: Surface Mount
U2 = CMP-0317-00001-1: High Performance Multibit Sigma-Delta DAC with SACD Playback, 5 V Power Supply, -40 to 85 degC, 28-Pin SSOP (RS-28), RoHS, Tube; Manufacturer: Analog Devices; Resolution (Bits): 24; DAC DNR (dB): 123; DAC Architecture: Sigma Delta; Max Sampling Rate (KHz): 192; Voltage Supply (V): 5; DAC THD+N @ 1 kHz (-3dB): 110; # DAC: 2; ComponentLink2URL: http://www.analog.com/static/imported-files/data_sheets/AD1955.pdf; PackageDescription: 28-Pin Shrink Small Outline Package, Body 10.2 x 5.3 mm, Pitch 0.65 mm; Packing: Tube; ComponentLink1URL: http://www.analog.com/; ComponentLink3Description: Package Specification; Temperature Range (degC): -40 to 85; PackageReference: RS-28; Mounting Technology: Surface Mount; RoHS: TRUE; PartNumber: AD1955ARSZ; ComponentLink2Description: Datasheet; PackageVersion: 060106-A; ComponentLink1Description: Manufacturer URL; DatasheetVersion: Rev. 0; ComponentLink3URL: http://www.analog.com/static/imported-files/packages/32122249223724RS_28.pdf
U3 = CMP-026-000000-1: Designed By @Alixahedi; Pin Count: 40; Design Item ID: BluePill; Source: Schlib1.SchLib; Component Type: Standard
U10 = CMP-1615-01070-2: Hex Inverters, PW0014A, LARGE T&R; Manufacturer: Texas Instruments; F @ Nom Voltage(Max)(Mhz): 110; Output Drive (IOL/IOH)(Max)(mA): -12/12; ICC @ Nom Voltage(Max)(mA): 0.02; Technology Family: LVT; Schmitt Trigger: No; VCC(Min)(V): 2; Rating: Catalog; VCC(Max)(V): 5.5; Input Type: CMOS,TTL; Output Type: CMOS; tpd @ Nom Voltage(Max)(ns): 8; Bits(#): 6; Voltage(Nom)(V): 5; DatasheetVersion: SCES130L; PackageReference: PW0014A; Code_JEDEC: MO-153; Operating Temperature Range(C): -40 to 85; Generic Part Number: SN74LVU04A
U12 = CMP-016-000000-1: 800-mA, 15-V, linear voltage regulator; MF: Texas Instruments; MP: REG1117-3.3; Pin Count: 4; Package: SOT-223-4 Texas Instruments; SnapEDA_Link: https://www.snapeda.com/parts/REG1117-3.3/Texas+Instruments/view-part/?ref=snap; Component Type: Standard; Check_prices: https://www.snapeda.com/parts/REG1117-3.3/Texas+Instruments/view-part/?ref=eda; Source: REG1117-3.3.SchLib; Value: *; Design Item ID: REG1117-3.3
U21-U26 = CMP-0384-00743-1: Single Channel Low Noise Operational Amplifier, 8 MHz BW, 20 V/us SR, Industrial, 8-pin SOIC (R-8), Tube; Manufacturer: Analog Devices; Generic Part Number: AD797; Input Bias Current: 250nA; Amplifiers Per Package: 1; Slew Rate: 20V/us; V Span Max: 36V; Input Offset Voltage: 25uV; V Span Min: 10V; Small Signal Bandwidth: 8MHz; Iq/Amp: 10.5mA; PackageVersion: 060506-A; PackageReference: R-8; ComponentLink2URL: http://www.analog.com/static/imported-files/data_sheets/AD797.pdf; DatasheetVersion: Rev. H; ComponentLink3Description: Package Specification; ComponentLink3URL: http://www.analog.com/static/imported-files/packages/PKG_PDF/SOIC_Narrow%20(R)/R_8.pdf; Code_JEDEC: MS-012-AA; ComponentLink1URL: http://www.analog.com/en/index.html; PackageDescription: 8-Pin Standard Small Outline Package, Body 3.9 x 4.9 mm, Pitch 1.27 mm; Mounting Technology: Surface Mount; ComponentLink2Description: Datasheet; PartNumber: AD797ARZ; ComponentLink1Description: Manufacturer URL
U30 = CMP-0440-00136-4: IC BUF NON-INVERT 5.5V 14DIP; Quiescent Current: 8uA; Number of Bits: 4; Propagation Delay: 32ns; Turn-On Delay Time: 50ns; Low Level Output Current: 6mA; Logic Function: Buffer; Number of Bits per Element: 1; Min Supply Voltage: 4.5V; Operating Supply Voltage: 5V; High Level Output Current: -6mA; Polarity: Non-Inverting; Radiation Hardening: No; Number of Inputs: 4; Case/Package: PDIP; Number of Input Lines: 4; Mount: Through Hole; Number of Pins: 14; Package Quantity: 25; Number of Circuits: 4; Number of Output Lines: 4; Packaging: Rail/Tube; REACH SVHC: No SVHC; Lead Free: Lead Free; Termination: Through Hole; Max Operating Temperature: 85°C; Number of Channels: 4; Number of Elements: 4; Min Operating Temperature: -40°C; Max Supply Voltage: 5.5V; Number of Outputs: 4
U50 U52 = CMP-0244-00213-1: Positive Voltage Regulator, 3-Pin D2PAK, Tape and Reel; PackageReference: TO-263; ComponentLink2URL: http://www.st.com/internet/com/TECHNICAL_RESOURCES/TECHNICAL_LITERATURE/DATASHEET/CD00000444.pdf; PackageDescription: 3-Pin Transistor Outline Package 2.54 mm Pitch, 15.4 mm Lead Span (D2PAK); DatasheetVersion: 16/11/2011; ComponentLink2Description: Datasheet; ComponentLink1Description: Manufacturer URL; PackageVersion: 2011; ComponentLink1URL: http://www.st.com
U51 = CMP-0244-00191-1: Negative Voltage Regulator, -5V, 3-Pin D2PAK, Tape and Reel; PackageReference: TO-263; ComponentLink2URL: http://www.st.com/internet/com/TECHNICAL_RESOURCES/TECHNICAL_LITERATURE/DATASHEET/CD00000450.pdf; PackageVersion: 2011; ComponentLink1Description: Manufacturer URL; ComponentLink2Description: Datasheet; PackageDescription: 3-Pin Transistor Outline Package 2.54 mm Pitch, 15.4 mm Lead Span (D2PAK); ComponentLink1URL: http://www.st.com; DatasheetVersion: 1/11/2011
Y10 = CMP-003-00030-1: 24.576 MHz Â±15ppm Crystal 8pF 60 Ohms 4-SMD, No Lead; MF: ECS Inc.; Component Type: Standard; MP: ECS-245.7-8-36-RWN-TR; SnapEDA_Link: https://www.snapeda.com/parts/ECS-245.7-8-36-RWN-TR/ECS/view-part/?ref=snap; Design Item ID: ECS-245.7-8-36-RWN-TR; Pins: 4; Case/Package: ECX-2236-36-4 ECS; Value: *; Check_prices: https://www.snapeda.com/parts/ECS-245.7-8-36-RWN-TR/ECS/view-part/?ref=eda; Source: ECS-245.7-8-36-RWN-TR.SchLib